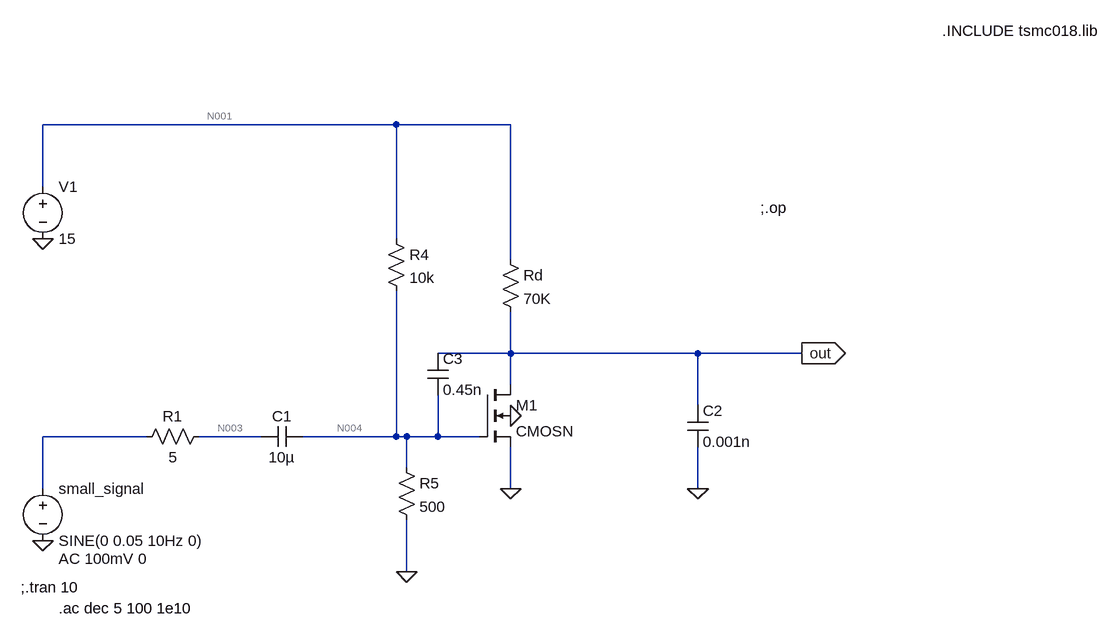
[diagram p0: schematic common source amplifier.asc]
common source amplifier.asc, the LTspice schematic file:
Version 4
SHEET 1 1148 680
WIRE 48 -304 -496 -304
WIRE 224 -304 48 -304
WIRE -496 -208 -496 -304
WIRE 48 -128 48 -304
WIRE 224 -96 224 -304
WIRE 224 48 224 -16
WIRE 224 48 112 48
WIRE 512 48 224 48
WIRE 672 48 512 48
WIRE 224 96 224 48
WIRE 512 128 512 48
WIRE -336 176 -496 176
WIRE -160 176 -256 176
WIRE 48 176 48 -48
WIRE 48 176 -96 176
WIRE 64 176 48 176
WIRE 112 176 112 112
WIRE 112 176 64 176
WIRE 176 176 112 176
WIRE 64 224 64 176
WIRE -496 256 -496 176
WIRE 224 256 224 192
WIRE 512 256 512 192
WIRE 64 384 64 304
FLAG -496 336 0
FLAG 224 256 0
FLAG 512 256 0
FLAG 672 48 out
IOPIN 672 48 Out
FLAG -496 -128 0
FLAG 64 384 0
FLAG 224 144 0
SYMBOL res -240 160 R90
WINDOW 0 0 56 VBottom 2
WINDOW 3 32 56 VTop 2
SYMATTR InstName R1
SYMATTR Value 5
SYMBOL voltage -496 240 R0
WINDOW 123 24 124 Left 2
WINDOW 39 0 0 Left 0
SYMATTR Value2 AC 100mV 0
SYMATTR InstName small_signal
SYMATTR Value SINE(0 0.05 10Hz 0)
SYMBOL res 208 -112 R0
SYMATTR InstName Rd
SYMATTR Value 70K
SYMBOL voltage -496 -224 R0
WINDOW 123 0 0 Left 0
WINDOW 39 0 0 Left 0
SYMATTR InstName V1
SYMATTR Value 15
SYMBOL res 32 -144 R0
SYMATTR InstName R4
SYMATTR Value 10k
SYMBOL res 48 208 R0
SYMATTR InstName R5
SYMATTR Value 500
SYMBOL cmosn 176 96 R0
SYMATTR InstName M1
SYMATTR Value2 l=510n w=5.5u
SYMBOL cap -96 160 R90
WINDOW 0 0 32 VBottom 2
WINDOW 3 32 32 VTop 2
SYMATTR InstName C1
SYMATTR Value 10µ
SYMBOL cap 496 128 R0
SYMATTR InstName C2
SYMATTR Value 0.001n
SYMBOL cap 96 48 R0
SYMATTR InstName C3
SYMATTR Value 0.45n
TEXT -530 408 Left 2 !;.tran 10
TEXT 888 -448 Left 2 !.INCLUDE tsmc018.lib
TEXT 608 -176 Left 2 !;.op
TEXT -472 440 Left 2 !.ac dec 5 100 1e10

The netlist it stands for:
* common source amplifier.asc
R1 N003 N002 5
V§small_signal N002 0 SINE(0 0.05 10Hz 0) AC 100mV 0
Rd N001 out 70K
V1 N001 0 15
R4 N001 N004 10k
R5 N004 0 500
M1 out N004 0 0 CMOSN l=510n w=5.5u
C1 N004 N003 10µ
C2 out 0 0.001n
C3 out N004 0.45n
.model NMOS NMOS
.model PMOS PMOS
.lib standard.mos
;.tran 10
.INCLUDE tsmc018.lib
;.op
.ac dec 5 100 1e10
.backanno
.end

* Results of the author's LTspice run, read from the files saved beside the schematic
* Operating Point, zero values left out:
*   V(n001) = 15 V
*   V(out) = 5.939 V
*   V(n004) = 714.3 mV
*   Id(M1) = 129.4 µA
*   Ib(M1) = -5.949 pA
*   Is(M1) = -129.4 µA
*   I(R5) = 1.429 mA
*   I(R4) = 1.429 mA
*   I(Rd) = 129.4 µA
*   I(V1) = -1.558 mA
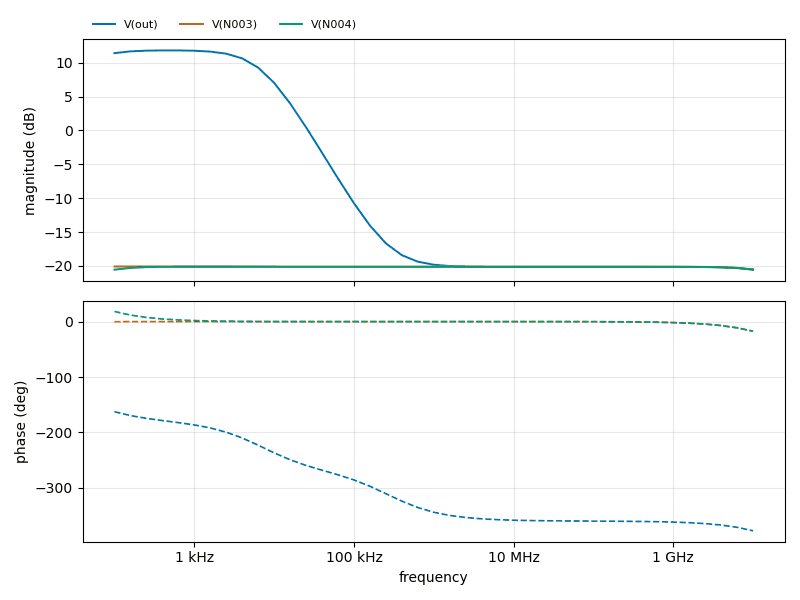
[diagram p1: AC Analysis of common source amplifier.asc, plotted from the saved traces]
* AC Analysis, 1 run:
*   V(out): 11.40 dB at 100 Hz, -20.55 dB at 10 GHz, peak 11.81 dB at 398.1 Hz, 3 dB below the peak at 6.952 kHz
*   V(N003): -20.08 dB at 100 Hz, -20.53 dB at 10 GHz, peak -20.08 dB at 100 Hz
*   V(N004): -20.56 dB at 100 Hz, -20.53 dB at 10 GHz, peak -20.11 dB at 1.585 kHz